# EAGLE schematic Friendship Pendant (EAGLE 9.5.1)
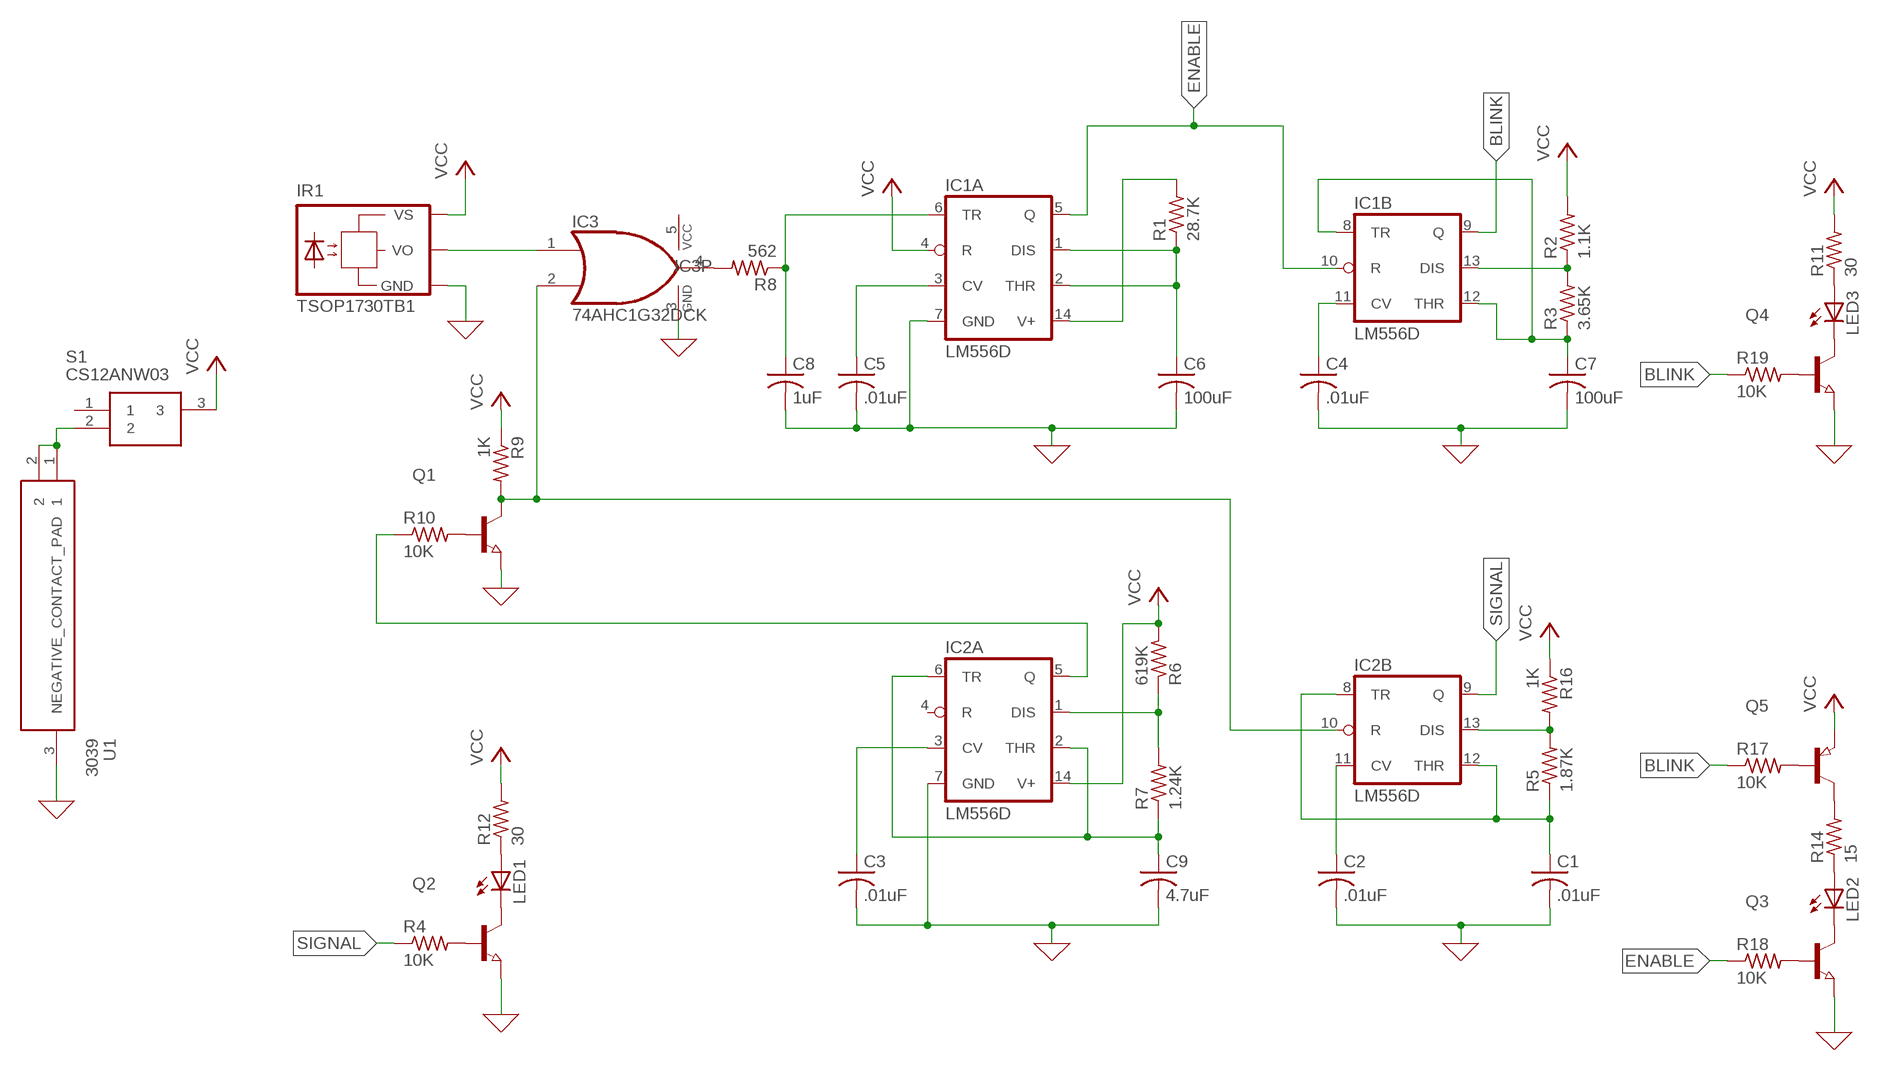
[diagram p0: schematic, sheet 1]

## Parts
C1  .01uF  C-USC0805  [C0805]
C2  .01uF  C-USC0805  [C0805]
C3  .01uF  C-USC0805  [C0805]
C4  .01uF  C-USC0805  [C0805]
C5  .01uF  C-USC0805  [C0805]
C6  100uF  C-USC0805  [C0805]
C7  100uF  C-USC0805  [C0805]
C8  1uF  C-USC0805  [C0805]
C9  4.7uF  C-USC0805  [C0805]
IC1  LM556D  [SO14]
IC2  LM556D  [SO14]
IC3  74AHC1G32DCK  [SC70-5]
IR1  TSOP1730TB1  [TSOP17_TB1]
LED1  LEDIRL80A  [IRL80A]
LED2  LED5MM  [LED5MM]
LED3  LED5MM  [LED5MM]
Q1  NPN-TRANSISTOR_SOT23  [SOT23]
Q2  NPN-TRANSISTOR_SOT23  [SOT23]
Q3  NPN-TRANSISTOR_SOT23  [SOT23]
Q4  NPN-TRANSISTOR_SOT23  [SOT23]
Q5  PNP-TRANSISTOR_SOT23  [SOT23]
R1  28.7K  R-US_R0805  [R0805]
R2  1.1K  R-US_R0805  [R0805]
R3  3.65K  R-US_R0805  [R0805]
R4  10K  R-US_R0805  [R0805]
R5  1.87K  R-US_R0805  [R0805]
R6  619K  R-US_R0805  [R0805]
R7  1.24K  R-US_R0805  [R0805]
R8  562  R-US_R0805  [R0805]
R9  1K  R-US_R0805  [R0805]
R10  10K  R-US_R0805  [R0805]
R11  30  R-US_R0805  [R0805]
R12  30  R-US_R0805  [R0805]
R14  15  R-US_R0805  [R0805]
R16  1K  R-US_R0805  [R0805]
R17  10K  R-US_R0805  [R0805]
R18  10K  R-US_R0805  [R0805]
R19  10K  R-US_R0805  [R0805]
S1  CS12ANW03  [CS12ANW03]
U1  3039  [3039]

## Nets
0: C1.2 C2.2 C3.2 C4.2 C5.2 C6.2 C7.2 C8.2 C9.2 IC1.7(A:GND) IC2.7(A:GND) IC3.3(GND) IR1.GND Q1.2(E) Q2.2(E) Q3.2(E) Q4.2(E) U1.3(NEGATIVE_CONTACT_PAD) ; supply symbol labelled GND
BLINK: IC1.9(B:Q) R17.1 R19.1
ENABLE: IC1.5(A:Q) IC1.10(B:R) R18.1
N$1: IC1.13(B:DIS) R2.1 R3.2
N$2: IC2.1(A:DIS) R6.1 R7.2
N$3: IC3.4(O) R8.2
N$4: IC2.10(B:R) IC3.2(I1) Q1.3(C) R9.2
N$5: LED1.A R12.1
N$6: Q3.1(B) R18.2
N$7: Q4.1(B) R19.2
N$8: Q5.1(B) R17.2
N$9: LED1.K(C) Q2.3(C)
N$10: Q2.1(B) R4.2
N$11: IC3.1(I0) IR1.VO
N$12: Q1.1(B) R10.2
N$13: IC2.5(A:Q) R10.1
N$14: C3.1 IC2.3(A:CV)
N$15: S1.2 U1.1 U1.2
N$16: C9.1 IC2.2(A:THR) IC2.6(A:TR) R7.1
N$17: C8.1 IC1.6(A:TR) R8.1
N$18: C5.1 IC1.3(A:CV)
N$19: C6.1 IC1.1(A:DIS) IC1.2(A:THR) R1.1
N$21: IC1.14(A:V+) R1.2
N$23: C4.1 IC1.11(B:CV)
N$24: C7.1 IC1.8(B:TR) IC1.12(B:THR) R3.1
N$27: LED3.A R11.1
N$28: LED3.K(C) Q4.3(C)
N$29: Q5.3(C) R14.2
N$30: LED2.A R14.1
N$31: LED2.K(C) Q3.3(C)
N$34: C2.1 IC2.11(B:CV)
N$35: C1.1 IC2.8(B:TR) IC2.12(B:THR) R5.1
N$36: IC2.13(B:DIS) R5.2 R16.2
SIGNAL: IC2.9(B:Q) R4.1
VCC: IC1.4(A:R) IC2.14(A:V+) IR1.VS Q5.2(E) R2.2 R6.2 R9.1 R11.2 R12.2 R16.1 S1.3
Unconnected: IC2.4(A:R) S1.1

## Power pins joined to a net without a drawn wire
VCC: IC3.5(VCC)

## Library data of the parts
C1 = rcl:C-US: CAPACITOR, American symbol; MOUSER#: 603-CC0805JRX7R9BB103; MPN: CC0805JRX7R9BB103; SPICEPREFIX: C
C2-C5 = rcl:C-US: CAPACITOR, American symbol; MOUSER#: 603-CC0805KRX7R9BB103; MPN: CC0805KRX7R9BB103; SPICEPREFIX: C
C6 C7 = rcl:C-US: CAPACITOR, American symbol; MOUSER#: 81-GRM31CR60J107KE39L; MPN: GRM31CR60J107KE39L; SPICEPREFIX: C
C8 = rcl:C-US: CAPACITOR, American symbol; MOUSER#: 80-C0805C105K3R; MPN: C0805C105K3R; SPICEPREFIX: C
C9 = rcl:C-US: CAPACITOR, American symbol; MOUSER#: 791-0805X475M250CT; MPN: 0805X475M250CT; SPICEPREFIX: C
IC1 IC2 = linear:*556: Dual TIMER; MOUSER#: 511-TS556IDTTR; MPN: TS556IDTTR
IC3 = 74xx-little-us:74*1G32: 2-input OR gate; MOUSER#: 595-SN74AUP1G32DCKR; MPN: SN74AUP1G32DCKR
IR1 = telefunken:TSOP17*TB1: TSOP17..TB1 IR Receiver Modules for Remote Control Systems Source: http://www.vishay.com/docs/82042/82042.pdf; MOUSER#: 78-TSOP31330; MPN: TSOP31330; OC_FARNELL: unknown; OC_NEWARK: unknown
LED1 = led:LED: LED OSRAM: - CHIPLED LG R971, LG N971, LY N971, LG Q971, LY Q971, LO R971, LY R971 LH N974, LH R974 LS Q976, LO Q976, LY Q976 LO Q996 - Hyper CHIPLED LW Q18S LB Q993, LB Q99A, LB R99A - SideLED LS A670, LO A670, LY A670, LG A670, LP A670 LB A673, LV A673, LT A673, LW A673 LH A674 LY A675 LS A676, LA A676, LO A676, LY A676, LW A676 LS A679, LY A679, LG A679 - Hyper Micro SIDELED® LS Y876, LA Y876, LO Y876, LY Y876 LT Y87S - SmartLED LW L88C, LW L88S LB L89C, LB L89S, LG L890 LS L89K, LO L89K, LY L89K LS L896, LA L896, LO L896, LY L896 - TOPLED LS T670, LO T670, LY T670, LG T670, LP T670 LSG T670, LSP T670, LSY T670, LOP T670, LYG T670 LG T671, LOG T671, LSG T671 LB T673, LV T673, LT T673, LW T673 LH T674 LS T676, LA T676, LO T676, LY T676, LB T676, LH T676, LSB T676, LW T676 LB T67C, LV T67C, LT T67C, LS T67K, LO T67K, LY T67K, LW E67C LS E67B, LA E67B, LO E67B, LY E67B, LB E67C, LV E67C, LT E67C LW T67C LS T679, LY T679, LG T679 LS T770, LO T770, LY T770, LG T770, LP T770 LB T773, LV T773, LT T773, LW T773 LH T774 LS E675, LA E675, LY E675, LS T675 LS T776, LA T776, LO T776, LY T776, LB T776 LHGB T686 LT T68C, LB T68C - Hyper Mini TOPLED® LB M676 - Mini TOPLED Santana® LG M470 LS M47K, LO M47K, LY M47K Source: http://www.osram.convergy.de LUXEON: - LUMILED® LXK2-PW12-R00, LXK2-PW12-S00, LXK2-PW14-U00, LXK2-PW14-V00 LXK2-PM12-R00, LXK2-PM12-S00, LXK2-PM14-U00 LXK2-PE12-Q00, LXK2-PE12-R00, LXK2-PE12-S00, LXK2-PE14-T00, LXK2-PE14-U00 LXK2-PB12-K00, LXK2-PB12-L00, LXK2-PB12-M00, LXK2-PB14-N00, LXK2-PB14-P00, LXK2-PB14-Q00 LXK2-PR12-L00, LXK2-PR12-M00, LXK2-PR14-Q00, LXK2-PR14-R00 LXK2-PD12-Q00, LXK2-PD12-R00, LXK2-PD12-S00 LXK2-PH12-R00, LXK2-PH12-S00 LXK2-PL12-P00, LXK2-PL12-Q00, LXK2-PL12-R00 Source: www.luxeon.com KINGBRIGHT: KA-3528ASYC Source: www.kingbright.com; MOUSER#: 782-TSAL6200; MPN: TSAL6200
LED2 = led:LED: LED OSRAM: - CHIPLED LG R971, LG N971, LY N971, LG Q971, LY Q971, LO R971, LY R971 LH N974, LH R974 LS Q976, LO Q976, LY Q976 LO Q996 - Hyper CHIPLED LW Q18S LB Q993, LB Q99A, LB R99A - SideLED LS A670, LO A670, LY A670, LG A670, LP A670 LB A673, LV A673, LT A673, LW A673 LH A674 LY A675 LS A676, LA A676, LO A676, LY A676, LW A676 LS A679, LY A679, LG A679 - Hyper Micro SIDELED® LS Y876, LA Y876, LO Y876, LY Y876 LT Y87S - SmartLED LW L88C, LW L88S LB L89C, LB L89S, LG L890 LS L89K, LO L89K, LY L89K LS L896, LA L896, LO L896, LY L896 - TOPLED LS T670, LO T670, LY T670, LG T670, LP T670 LSG T670, LSP T670, LSY T670, LOP T670, LYG T670 LG T671, LOG T671, LSG T671 LB T673, LV T673, LT T673, LW T673 LH T674 LS T676, LA T676, LO T676, LY T676, LB T676, LH T676, LSB T676, LW T676 LB T67C, LV T67C, LT T67C, LS T67K, LO T67K, LY T67K, LW E67C LS E67B, LA E67B, LO E67B, LY E67B, LB E67C, LV E67C, LT E67C LW T67C LS T679, LY T679, LG T679 LS T770, LO T770, LY T770, LG T770, LP T770 LB T773, LV T773, LT T773, LW T773 LH T774 LS E675, LA E675, LY E675, LS T675 LS T776, LA T776, LO T776, LY T776, LB T776 LHGB T686 LT T68C, LB T68C - Hyper Mini TOPLED® LB M676 - Mini TOPLED Santana® LG M470 LS M47K, LO M47K, LY M47K Source: http://www.osram.convergy.de LUXEON: - LUMILED® LXK2-PW12-R00, LXK2-PW12-S00, LXK2-PW14-U00, LXK2-PW14-V00 LXK2-PM12-R00, LXK2-PM12-S00, LXK2-PM14-U00 LXK2-PE12-Q00, LXK2-PE12-R00, LXK2-PE12-S00, LXK2-PE14-T00, LXK2-PE14-U00 LXK2-PB12-K00, LXK2-PB12-L00, LXK2-PB12-M00, LXK2-PB14-N00, LXK2-PB14-P00, LXK2-PB14-Q00 LXK2-PR12-L00, LXK2-PR12-M00, LXK2-PR14-Q00, LXK2-PR14-R00 LXK2-PD12-Q00, LXK2-PD12-R00, LXK2-PD12-S00 LXK2-PH12-R00, LXK2-PH12-S00 LXK2-PL12-P00, LXK2-PL12-Q00, LXK2-PL12-R00 Source: www.luxeon.com KINGBRIGHT: KA-3528ASYC Source: www.kingbright.com; MOUSER#: 859-LTL-307GLC; MPN: LTL-307GLC
LED3 = led:LED: LED OSRAM: - CHIPLED LG R971, LG N971, LY N971, LG Q971, LY Q971, LO R971, LY R971 LH N974, LH R974 LS Q976, LO Q976, LY Q976 LO Q996 - Hyper CHIPLED LW Q18S LB Q993, LB Q99A, LB R99A - SideLED LS A670, LO A670, LY A670, LG A670, LP A670 LB A673, LV A673, LT A673, LW A673 LH A674 LY A675 LS A676, LA A676, LO A676, LY A676, LW A676 LS A679, LY A679, LG A679 - Hyper Micro SIDELED® LS Y876, LA Y876, LO Y876, LY Y876 LT Y87S - SmartLED LW L88C, LW L88S LB L89C, LB L89S, LG L890 LS L89K, LO L89K, LY L89K LS L896, LA L896, LO L896, LY L896 - TOPLED LS T670, LO T670, LY T670, LG T670, LP T670 LSG T670, LSP T670, LSY T670, LOP T670, LYG T670 LG T671, LOG T671, LSG T671 LB T673, LV T673, LT T673, LW T673 LH T674 LS T676, LA T676, LO T676, LY T676, LB T676, LH T676, LSB T676, LW T676 LB T67C, LV T67C, LT T67C, LS T67K, LO T67K, LY T67K, LW E67C LS E67B, LA E67B, LO E67B, LY E67B, LB E67C, LV E67C, LT E67C LW T67C LS T679, LY T679, LG T679 LS T770, LO T770, LY T770, LG T770, LP T770 LB T773, LV T773, LT T773, LW T773 LH T774 LS E675, LA E675, LY E675, LS T675 LS T776, LA T776, LO T776, LY T776, LB T776 LHGB T686 LT T68C, LB T68C - Hyper Mini TOPLED® LB M676 - Mini TOPLED Santana® LG M470 LS M47K, LO M47K, LY M47K Source: http://www.osram.convergy.de LUXEON: - LUMILED® LXK2-PW12-R00, LXK2-PW12-S00, LXK2-PW14-U00, LXK2-PW14-V00 LXK2-PM12-R00, LXK2-PM12-S00, LXK2-PM14-U00 LXK2-PE12-Q00, LXK2-PE12-R00, LXK2-PE12-S00, LXK2-PE14-T00, LXK2-PE14-U00 LXK2-PB12-K00, LXK2-PB12-L00, LXK2-PB12-M00, LXK2-PB14-N00, LXK2-PB14-P00, LXK2-PB14-Q00 LXK2-PR12-L00, LXK2-PR12-M00, LXK2-PR14-Q00, LXK2-PR14-R00 LXK2-PD12-Q00, LXK2-PD12-R00, LXK2-PD12-S00 LXK2-PH12-R00, LXK2-PH12-S00 LXK2-PL12-P00, LXK2-PL12-Q00, LXK2-PL12-R00 Source: www.luxeon.com KINGBRIGHT: KA-3528ASYC Source: www.kingbright.com; MOUSER#: 645-521-9672F; MPN: 521-9672F
Q1-Q4 = semicon-smd-ipc:NPN-TRANSISTOR_: NPN TRANSISTOR; MOUSER#: 726-BCW66KHE6327HTSA1; MPN: BCW66KHE6327HTSA1; SPICEPREFIX: Q
Q5 = semicon-smd-ipc:PNP-TRANSISTOR_: PNP TRANSISTOR; MOUSER#: 583-BC856A-T; MPN: BC856A-T
R1 = rcl:R-US_: RESISTOR, American symbol; MOUSER#: 652-CR0805-FX-2872ELF; MPN: CR0805-FX-2872ELF; SPICEPREFIX: R
R2 = rcl:R-US_: RESISTOR, American symbol; MOUSER#: 652-CR0805-FX-1101ELF; MPN: CR0805-FX-1101ELF; SPICEPREFIX: R
R3 = rcl:R-US_: RESISTOR, American symbol; MOUSER#: 652-CR0805-FX-3651ELF; MPN: CR0805-FX-3651ELF; SPICEPREFIX: R
R4 R10 R17-R19 = rcl:R-US_: RESISTOR, American symbol; MOUSER#: 652-CR0805-FX-1002ELF; MPN: CR0805-FX-1002ELF; SPICEPREFIX: R
R5 = rcl:R-US_: RESISTOR, American symbol; MOUSER#: 652-CR0805-FX-1871ELF; MPN: CR0805-FX-1871ELF; SPICEPREFIX: R
R6 = rcl:R-US_: RESISTOR, American symbol; MOUSER#: 652-CR0805-FX-6193ELF; MPN: CR0805-FX-6193ELF; SPICEPREFIX: R
R7 = rcl:R-US_: RESISTOR, American symbol; MOUSER#: 652-CR0805-FX-1241ELF; MPN: CR0805-FX-1241ELF; SPICEPREFIX: R
R8 = rcl:R-US_: RESISTOR, American symbol; MOUSER#: 652-CR0805-FX-5620ELF; MPN: CR0805-FX-5620ELF; SPICEPREFIX: R
R9 R16 = rcl:R-US_: RESISTOR, American symbol; MOUSER#: 652-CR0805-FX-1001ELF; MPN: CR0805-FX-1001ELF; SPICEPREFIX: R
R11 R12 = rcl:R-US_: RESISTOR, American symbol; MOUSER#: 652-CR0805-JW-300ELF; MPN: CR0805-JW-300ELF; SPICEPREFIX: R
R14 = rcl:R-US_: RESISTOR, American symbol; MOUSER#: 652-CR0805-FX-15R0ELF; MPN: CR0805-FX-15R0ELF; SPICEPREFIX: R
S1 = CS12ANW03:CS12ANW03: NKK SWITCHES - CS12ANW03 - SWITCH, SLIDE, SPDT, 3A, 250V, TH Source: Datasheet <http://www.nkkswitches.com/pdf/cs.pdf>; ALLIED_NUMBER: 70228233; ALLIED_PRICE-STOCK: https://www.alliedelec.com/nkk-switches-cs12anw03/70228233/; DESCRIPTION: NKK SWITCHES - CS12ANW03 - SWITCH, SLIDE, SPDT, 3A, 250V, TH; HEIGHT: mm; MANUFACTURER_NAME: NKK Switches; MANUFACTURER_PART_NUMBER: CS12ANW03; MOUSER_PART_NUMBER: 633-CS12ANW03; MOUSER_PRICE-STOCK: https://www.mouser.com/Search/Refine.aspx?Keyword=633-CS12ANW03; RS_PART_NUMBER: 1251847; RS_PRICE-STOCK: http://uk.rs-online.com/web/p/products/1251847
U1 = 3039:3039: Coin Cell Battery Holders THM COIN CELL CLIP Source: Datasheet <https://componentsearchengine.com/Datasheets/1/3039.pdf>; DESCRIPTION: Coin Cell Battery Holders THM COIN CELL CLIP; HEIGHT: mm; MANUFACTURER_NAME: Keystone Electronics; MANUFACTURER_PART_NUMBER: 3039; MOUSER#: 534-3039; MOUSER_PART_NUMBER: 534-3039; MOUSER_PRICE-STOCK: https://www.mouser.com/Search/Refine.aspx?Keyword=534-3039; MPN: 3039